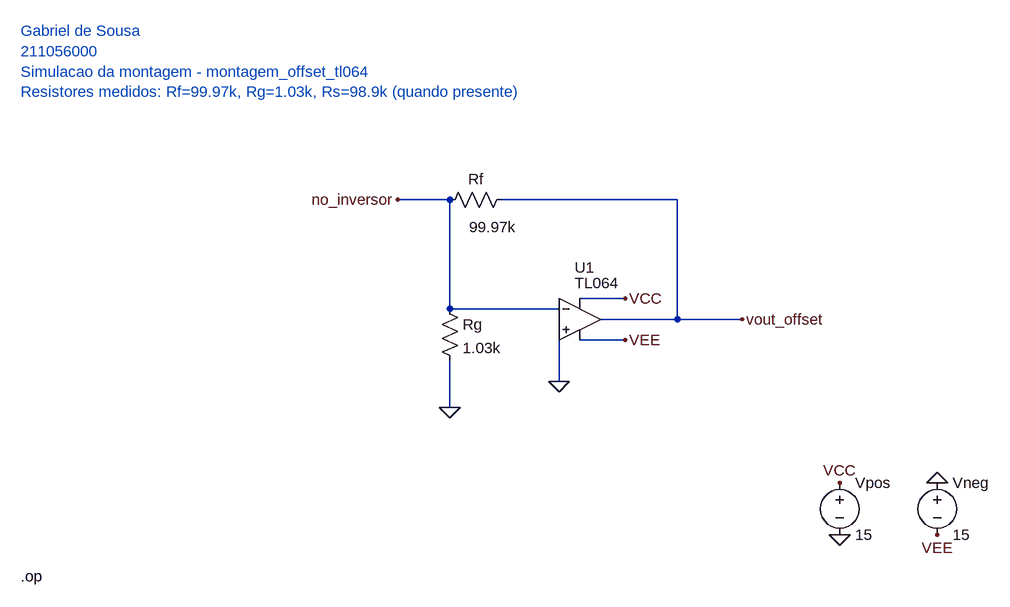
[diagram p0: schematic montagem_offset_tl064.asc]
montagem_offset_tl064.asc, the LTspice schematic file:
Version 4.1
SHEET 1 1600 850
WIRE 868 348 700 348
WIRE 700 348 700 180
WIRE 700 428 700 500
WIRE 780 180 1050 180
WIRE 1050 180 1050 364
WIRE 932 364 1150 364
WIRE 868 380 868 460
WIRE 900 332 970 332
WIRE 900 396 970 396
FLAG 700 500 0
FLAG 1150 364 vout_offset
FLAG 868 460 0
FLAG 970 332 VCC
FLAG 970 396 VEE
FLAG 1300 616 VCC
FLAG 1300 696 0
FLAG 1450 616 0
FLAG 1450 696 VEE
SYMBOL TL064 900 300 R0
WINDOW 0 -8 -16 Left 2
WINDOW 3 -8 8 Left 2
SYMATTR InstName U1
SYMBOL res 684 332 R0
SYMATTR InstName Rg
SYMATTR Value 1.03k
SYMBOL res 796 164 R90
WINDOW 0 0 56 VBottom 2
WINDOW 3 58 30 VCenter 2
SYMATTR InstName Rf
SYMATTR Value 99.97k
SYMBOL voltage 1300 600 R0
SYMATTR InstName Vpos
SYMATTR Value 15
SYMBOL voltage 1450 600 R0
SYMATTR InstName Vneg
SYMATTR Value 15
TEXT 40 -80 Left 2 ;Gabriel de Sousa\n211056000\nSimulacao da montagem - montagem_offset_tl064\nResistores medidos: Rf=99.97k, Rg=1.03k, Rs=98.9k (quando presente)
TEXT 40 760 Left 2 !.op
WIRE 620 180 700 180
FLAG 620 180 no_inversor

The netlist it stands for:
* montagem_offset_tl064.asc
* U1: TL064 (symbol TL064 not available, pins judged from their places): In+=0 In-=no_inversor V+=VCC V-=VEE OUT=vout_offset
Rg no_inversor 0 1.03k
Rf vout_offset no_inversor 99.97k
Vpos VCC 0 15
Vneg 0 VEE 15
* Gabriel de Sousa
* 211056000
* Simulacao da montagem - montagem_offset_tl064
* Resistores medidos: Rf=99.97k, Rg=1.03k, Rs=98.9k (quando presente)
.op
.backanno
.end